# Altium schematic sheet 3u.SchDoc
size A
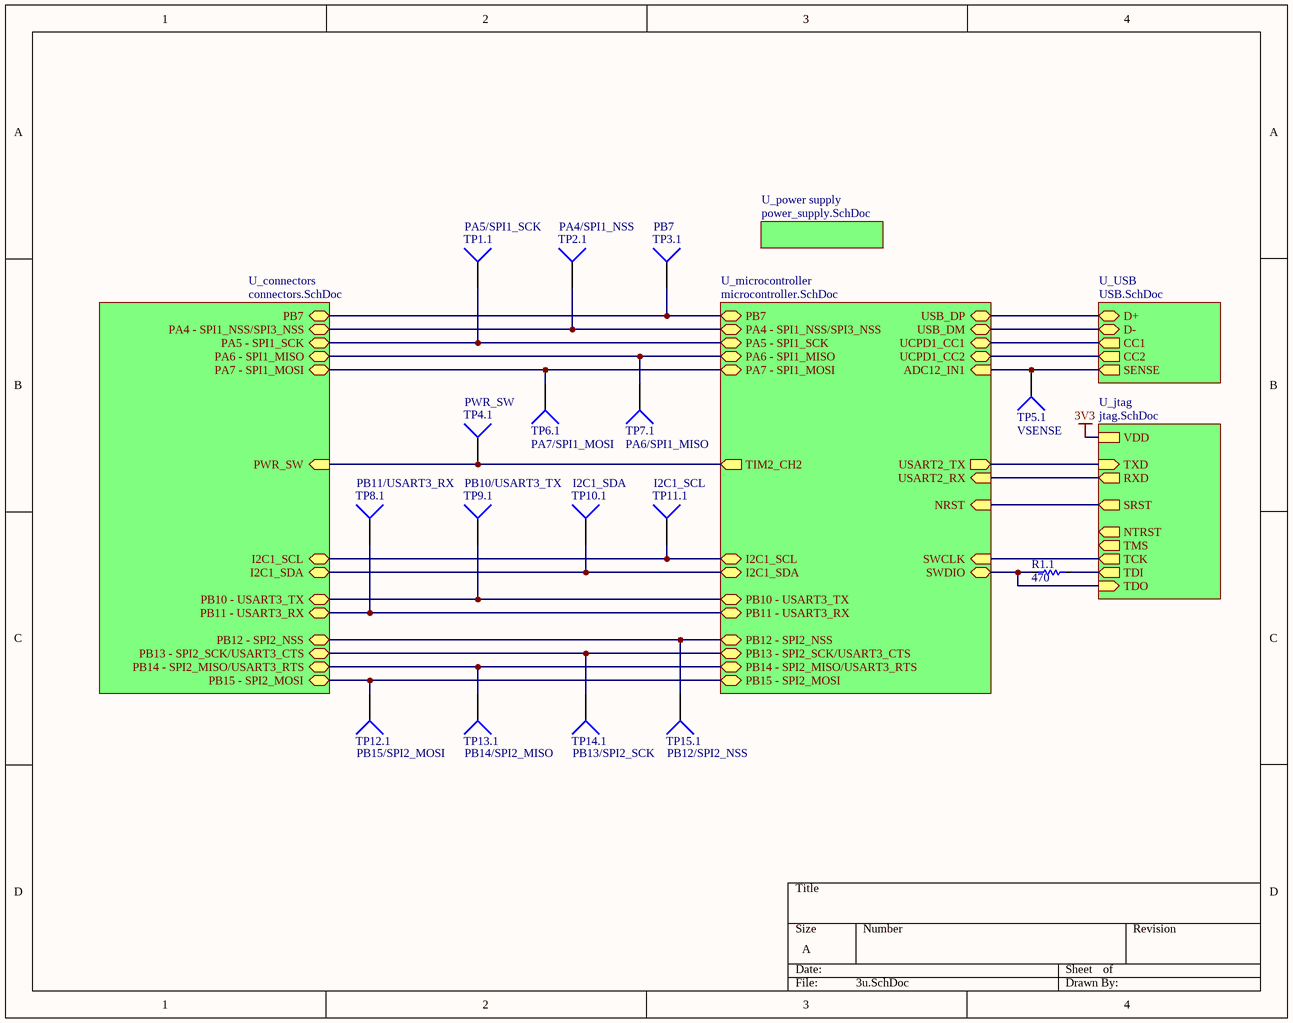
[diagram p0: 3u.SchDoc]

## Parts
R1.1  470  [0402]
TP1.1  PA5/SPI1_SCK  [Test Point Target 1mm]  (no BOM)
TP2.1  PA4/SPI1_NSS  [Test Point Target 1mm]  (no BOM)
TP3.1  PB7  [Test Point Target 1mm]  (no BOM)
TP4.1  PWR_SW  [Test Point Target 1mm]  (no BOM)
TP5.1  VSENSE  [Test Point Target 1mm]  (no BOM)
TP6.1  PA7/SPI1_MOSI  [Test Point Target 1mm]  (no BOM)
TP7.1  PA6/SPI1_MISO  [Test Point Target 1mm]  (no BOM)
TP8.1  PB11/USART3_RX  [Test Point Target 1mm]  (no BOM)
TP9.1  PB10/USART3_TX  [Test Point Target 1mm]  (no BOM)
TP10.1  I2C1_SDA  [Test Point Target 1mm]  (no BOM)
TP11.1  I2C1_SCL  [Test Point Target 1mm]  (no BOM)
TP12.1  PB15/SPI2_MOSI  [Test Point Target 1mm]  (no BOM)
TP13.1  PB14/SPI2_MISO  [Test Point Target 1mm]  (no BOM)
TP14.1  PB13/SPI2_SCK  [Test Point Target 1mm]  (no BOM)
TP15.1  PB12/SPI2_NSS  [Test Point Target 1mm]  (no BOM)

## Sub-sheets
U_connectors = connectors.SchDoc: I2C1_SCL (bidir), PB12 - SPI2_NSS (bidir), PB15 - SPI2_MOSI (bidir), PB7 (bidir), PB10 - USART3_TX (bidir), PB11 - USART3_RX (bidir), PB13 - SPI2_SCK/USART3_CTS (bidir), PA7 - SPI1_MOSI (bidir), PB14 - SPI2_MISO/USART3_RTS (bidir), I2C1_SDA (bidir), PA6 - SPI1_MISO (bidir), PA5 - SPI1_SCK (bidir), PA4 - SPI1_NSS/SPI3_NSS (bidir), PWR_SW (in)
U_jtag = jtag.SchDoc: TDI (out), TMS (out), TCK (out), TDO (in), SRST (out), RXD (out), NTRST (out), TXD (in), VDD
U_microcontroller = microcontroller.SchDoc: NRST (in), I2C1_SDA (bidir), I2C1_SCL (bidir), USART2_TX (out), USART2_RX (in), USB_DM (bidir), USB_DP (bidir), UCPD1_CC1 (bidir), UCPD1_CC2 (bidir), SWDIO (bidir), SWCLK (in), ADC12_IN1 (in), PB11 - USART3_RX (bidir), PB15 - SPI2_MOSI (bidir), PB14 - SPI2_MISO/USART3_RTS (bidir), PB10 - USART3_TX (bidir), PB13 - SPI2_SCK/USART3_CTS (bidir), PB12 - SPI2_NSS (bidir), PA7 - SPI1_MOSI (bidir), PA6 - SPI1_MISO (bidir), PA5 - SPI1_SCK (bidir), PA4 - SPI1_NSS/SPI3_NSS (bidir), PB7 (bidir), TIM2_CH2 (out)
U_power supply = power_supply.SchDoc: no entries
U_USB = USB.SchDoc: D- (bidir), D+ (bidir), CC2 (out), CC1 (out), SENSE (out)

## Nets
3V3: sheet U_jtag/VDD
NetR1.1_1: R1.1.1 ; sheet U_jtag/TDI
NetR1.1_2: R1.1.2 ; sheet U_microcontroller/SWDIO, sheet U_jtag/TDO
NetTP1.1_1: TP1.1.1 ; sheet U_microcontroller/PA5 - SPI1_SCK, sheet U_connectors/PA5 - SPI1_SCK
NetTP2.1_1: TP2.1.1 ; sheet U_microcontroller/PA4 - SPI1_NSS/SPI3_NSS, sheet U_connectors/PA4 - SPI1_NSS/SPI3_NSS
NetTP3.1_1: TP3.1.1 ; sheet U_microcontroller/PB7, sheet U_connectors/PB7
NetTP4.1_1: TP4.1.1 ; sheet U_microcontroller/TIM2_CH2, sheet U_connectors/PWR_SW
NetTP5.1_1: TP5.1.1 ; sheet U_microcontroller/ADC12_IN1, sheet U_USB/SENSE
NetTP6.1_1: TP6.1.1 ; sheet U_microcontroller/PA7 - SPI1_MOSI, sheet U_connectors/PA7 - SPI1_MOSI
NetTP7.1_1: TP7.1.1 ; sheet U_microcontroller/PA6 - SPI1_MISO, sheet U_connectors/PA6 - SPI1_MISO
NetTP8.1_1: TP8.1.1 ; sheet U_microcontroller/PB11 - USART3_RX, sheet U_connectors/PB11 - USART3_RX
NetTP9.1_1: TP9.1.1 ; sheet U_microcontroller/PB10 - USART3_TX, sheet U_connectors/PB10 - USART3_TX
NetTP10.1_1: TP10.1.1 ; sheet U_microcontroller/I2C1_SDA, sheet U_connectors/I2C1_SDA
NetTP11.1_1: TP11.1.1 ; sheet U_microcontroller/I2C1_SCL, sheet U_connectors/I2C1_SCL
NetTP12.1_1: TP12.1.1 ; sheet U_microcontroller/PB15 - SPI2_MOSI, sheet U_connectors/PB15 - SPI2_MOSI
NetTP13.1_1: TP13.1.1 ; sheet U_microcontroller/PB14 - SPI2_MISO/USART3_RTS, sheet U_connectors/PB14 - SPI2_MISO/USART3_RTS
NetTP14.1_1: TP14.1.1 ; sheet U_microcontroller/PB13 - SPI2_SCK/USART3_CTS, sheet U_connectors/PB13 - SPI2_SCK/USART3_CTS
NetTP15.1_1: TP15.1.1 ; sheet U_microcontroller/PB12 - SPI2_NSS, sheet U_connectors/PB12 - SPI2_NSS
(unnamed): sheet U_microcontroller/NRST, sheet U_jtag/SRST
(unnamed): sheet U_microcontroller/USART2_TX, sheet U_jtag/TXD
(unnamed): sheet U_microcontroller/USART2_RX, sheet U_jtag/RXD
(unnamed): sheet U_microcontroller/USB_DM, sheet U_USB/D-
(unnamed): sheet U_microcontroller/USB_DP, sheet U_USB/D+
(unnamed): sheet U_microcontroller/UCPD1_CC1, sheet U_USB/CC1
(unnamed): sheet U_microcontroller/UCPD1_CC2, sheet U_USB/CC2
(unnamed): sheet U_microcontroller/SWCLK, sheet U_jtag/TCK

## Library data of the parts
R1.1 = RESISTOR: Value: 470
TP1.1 TP2.1 TP3.1 TP4.1 TP5.1 TP6.1 TP7.1 TP8.1 TP9.1 TP10.1 TP11.1 TP12.1 TP13.1 TP14.1 TP15.1 = Socket: LatestRevisionDate: 17-Jul-2002; LatestRevisionNote: Re-released for DXP Platform.; Publisher: Altium Limited